# Altium project WS485H-V1_Project.PrjPcb
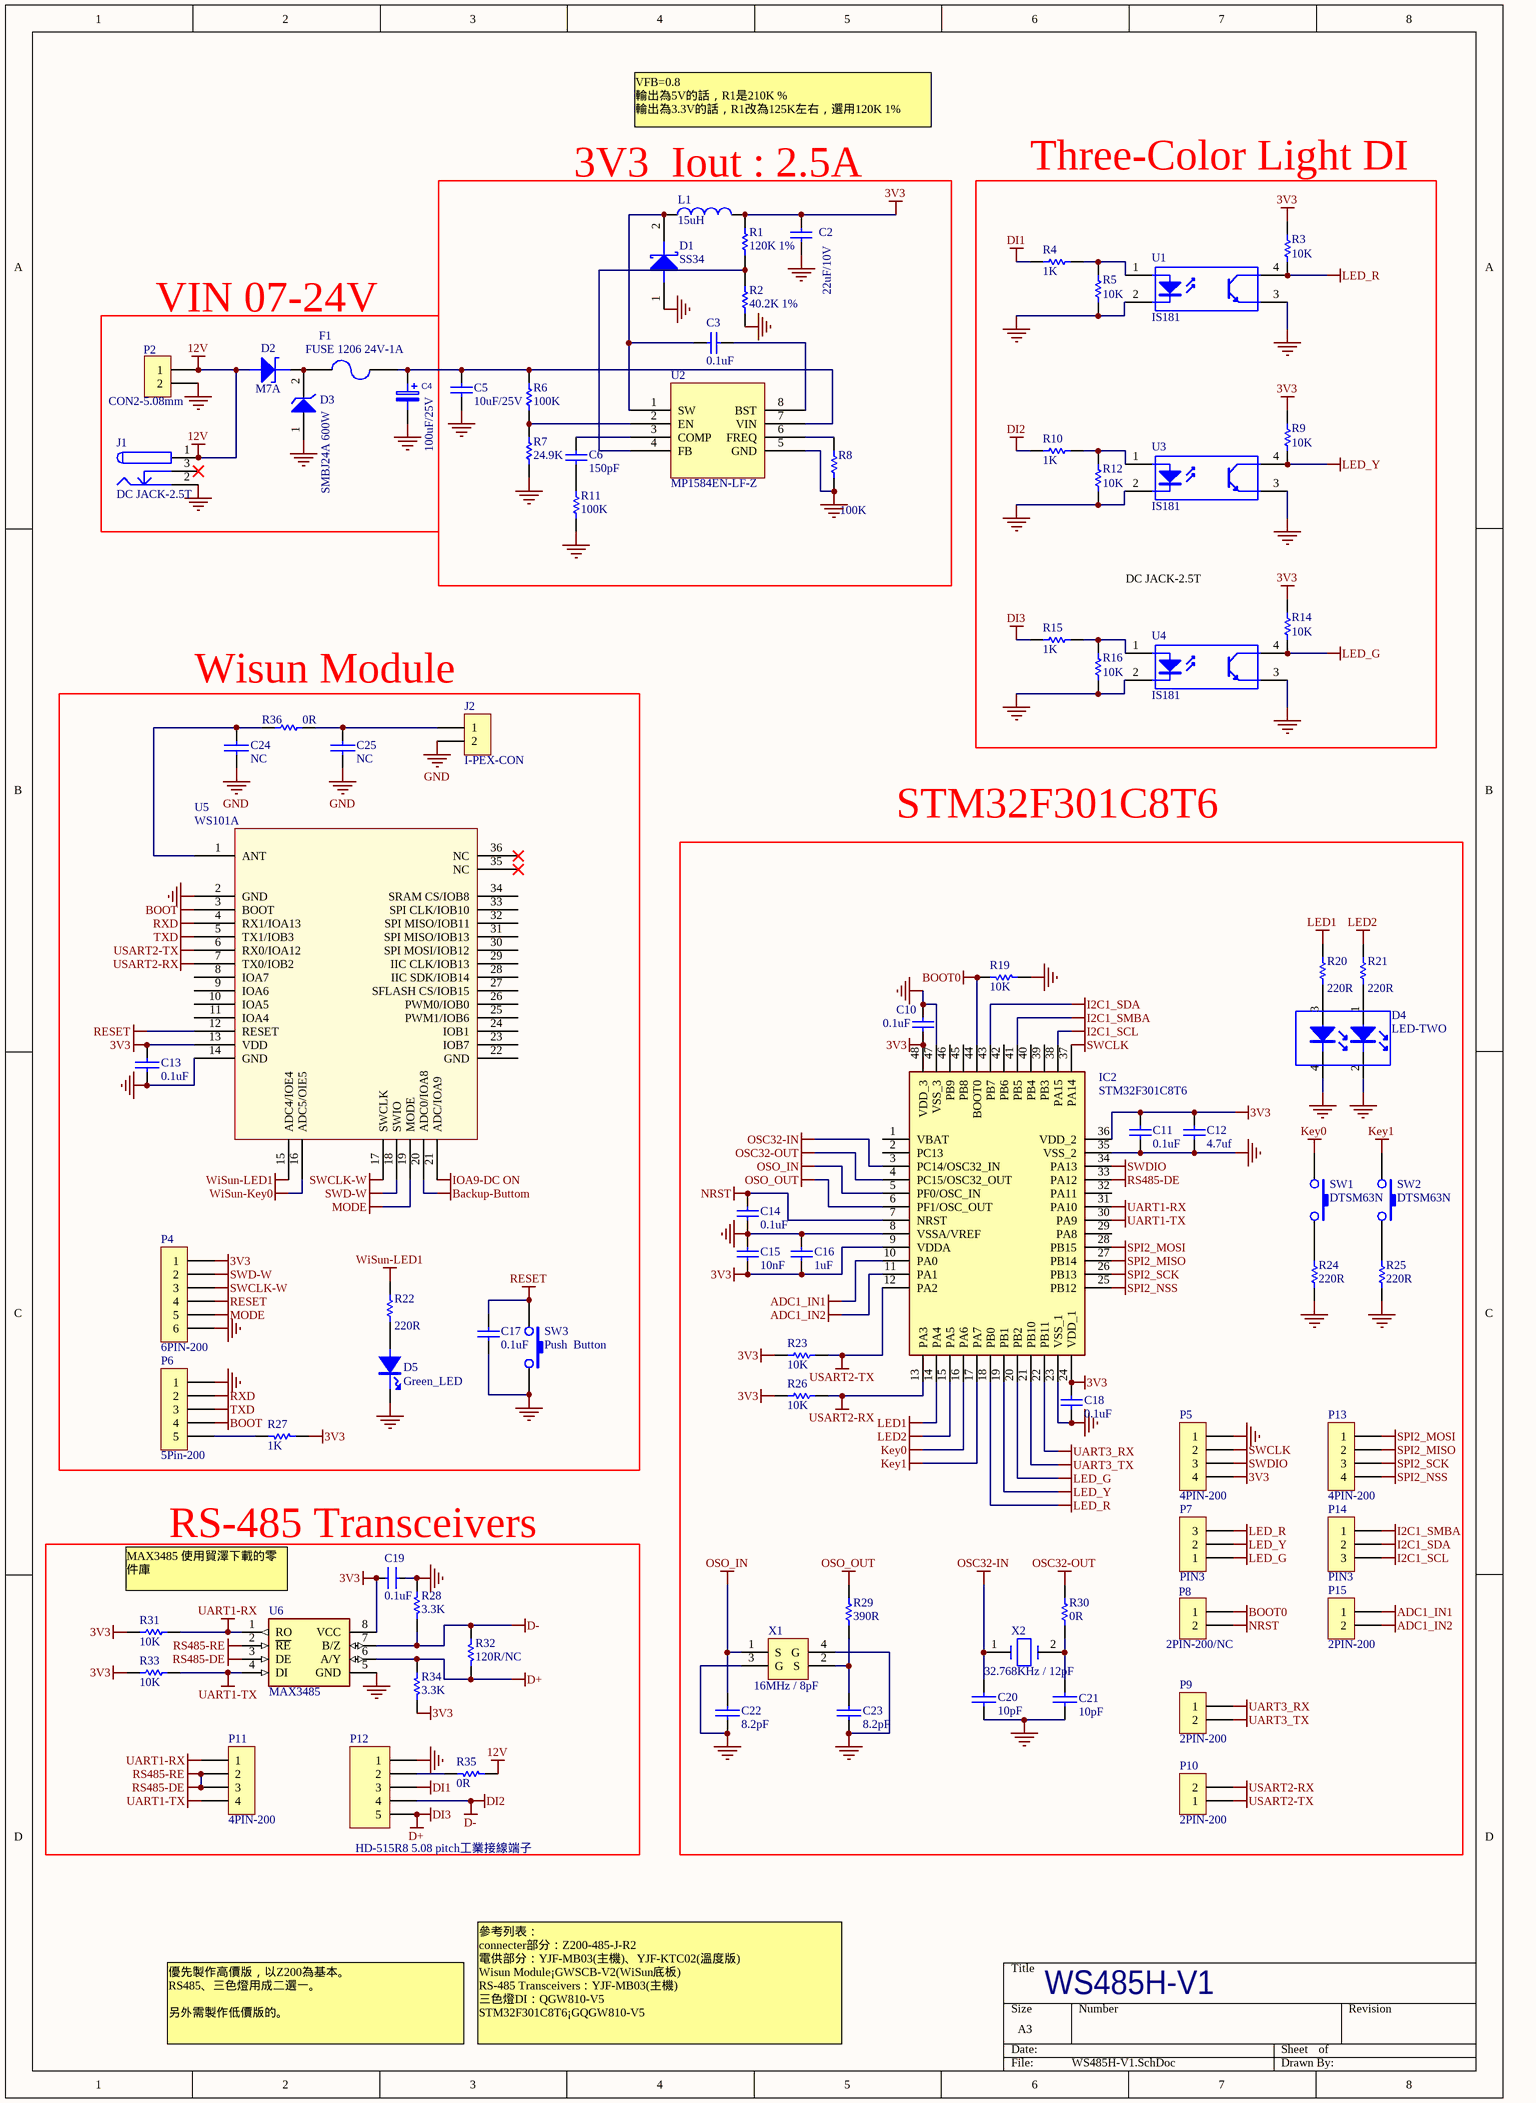
[diagram p0: WS485H-V1.SchDoc]
1 sheet, 88 parts. Net scope: global (net labels, ports and power ports of the same name join across sheets).
Board file: WS485H-V1.PcbDoc

## Sheet WS485H-V1.SchDoc: WS485H-V1
size A3 portrait; Author: Fred; PageSetup: Record=PageOptions|CenterHorizontal=True|CenterVertical=True|PrintScale=1.04|XCorrection=1.00|YCorrection=1.00|PrintKind=0|BorderSize=5000000|LeftOffset=0|BottomOffset=0|Orientation=1|PaperLength=1000|PaperWidth=1000|Scale=100|PaperSource=7|PrintQuality=-4|MediaType=1|DitherType=10|PaperKind=A3|PrintScaleMode=1

### Parts
C2  22uF/10V  [0402C]
C3  0.1uF  [0402C]
C4  100uF/25V  [DIP CAP-8*3.5]
C5  10uF/25V  [0805C]
C6  150pF  [0402C]
C10  0.1uF  [0402C]
C11  0.1uF  [0402C]
C12  value 4.7uf  [0402C]  (hidden comment: 0.1uF)
C13  0.1uF  [0402C]
C14  0.1uF  [0402C]
C15  value 10nF  [0603C]  (hidden comment: 0.1uF)
C16  value 1uF  [0402C]  (hidden comment: 0.1uF)
C17  0.1uF  [0402C]
C18  0.1uF  [0402C]
C19  0.1uF  [0402C]
C20  10pF  [0402C]
C21  10pF  [0402C]
C22  8.2pF  [0402C]
C23  8.2pF  [0402C]
C24  NC  [0402C]
C25  NC  [0402C]
D1  SS34  [SMBJ40CA(TVS)]
D2  M7A  [DIODE-SMA]
D3  SMBJ24A 600W  [SMBJ40CA(TVS)]
D4  LED-TWO  [LEDX2HOLD]
D5  Green_LED  [LED0603--0.4mm]
F1  FUSE 1206 24V-1A  [1206-FUSE]
IC2  STM32F301C8T6  [QFP50P900X900X160-48N]
J1  DC JACK-2.5T  [DC JACK-2.5T-NEW]
J2  I-PEX-CON  [I-PEX-CON]
L1  15uH  [L8.3x8.3]
P2  CON2-5.08mm  [OQ5.08-90D-2P]
P4  6PIN-200  [6PIN-200]
P5  4PIN-200  [4PIN-200]
P6  5Pin-200  [5pin-200]
P7  PIN3  [3PIN-200]
P8  2PIN-200/NC  [2PIN-200]
P9  2PIN-200  [2PIN-200]
P10  2PIN-200  [2PIN-200]
P11  4PIN-200  [4PIN-200]
P12  HD-515R8 5.08 pitch工業接線端子  [OQ5.08-90D-5P]
P13  4PIN-200  [4PIN-200]
P14  PIN3  [3PIN-200]
P15  2PIN-200  [2PIN-200]
R1  value 120K 1%  [0402]  (hidden comment: 210K 1%)
R2  40.2K 1%  [0402]
R3  10K  [0402]
R4  1K  [0402]
R5  10K  [0402]
R6  100K  [0402]
R7  24.9K  [0402]
R8  100K  [0402]
R9  10K  [0402]
R10  1K  [0402]
R11  100K  [0402]
R12  10K  [0402]
R14  10K  [0402]
R15  1K  [0402]
R16  10K  [0402]
R19  10K  [0402]
R20  220R  [0603]
R21  220R  [0603]
R22  220R  [0402]
R23  10K  [0402]
R24  220R  [0603]
R25  220R  [0603]
R26  10K  [0402]
R27  1K  [0402]
R28  3.3K  [0603]
R29  390R  [0402]
R30  0R  [0402]
R31  10K  [0402]
R32  120R/NC  [0603]
R33  10K  [0402]
R34  3.3K  [0603]
R35  0R  [0805]
R36  0R  [0603]
SW1  DTSM63N  [SW-AT-1102VT1-new]
SW2  DTSM63N  [SW-AT-1102VT1-new]
SW3  Push  Button  [Button_2pin-3*4*2MM]
U1  IS181  [IS181-SMD]
U2  MP1584EN-LF-Z  [SOIC8E_MP1584EN]
U3  IS181  [IS181-SMD]
U4  IS181  [IS181-SMD]
U5  WS101A  [WS101A]
U6  MAX3485  [SOIC127P600X175-8N]
X1  16MHz / 8pF  [XTAL-SMD-20X16]
X2  32.768KHz / 12pF  [XTAL-SMD-32*15]

### Blocks framed on the sheet
3V3  Iout : 2.5A: C2 C3 C5 C6 D1 L1 R1 R2 R6-R8 R11 U2
Three-Color Light DI: R3-R5 R9 R10 R12 R14-R16 U1 U3 U4
VIN 07-24V: C4 D2 D3 F1 J1 P2
Wisun Module: C13 C17 C24 C25 D5 J2 P4 P6 R22 R27 R36 SW3 U5
STM32F301C8T6: C10-C12 C14-C16 C18 C20-C23 D4 IC2 P5 P7-P10 P13-P15 R19-R21 R23-R26 R29 R30 SW1 SW2 X1 X2
RS-485 Transceivers: C19 P11 P12 R28 R31-R35 U6

### Nets
3V3: C2.2 C10.2 C11.1 C12.1 C13.2 C15.1 C16.1 C18.1 C19.1 IC2.9(VDDA) IC2.24(VDD_1) IC2.36(VDD_2) IC2.48(VDD_3) L1.2 P4.1 P5.4 R1.2 R3.2 R9.2 R14.2 R23.2 R26.2 R27.1 R31.2 R33.2 R34.2 U5.13(VDD) U6.8(VCC)
12V: D2.1 J1.1 P2.1 R35.1
ADC1_IN1: IC2.10(PA0) P15.1
ADC1_IN2: IC2.11(PA1) P15.2
Backup-Buttom: U5.20(ADC0/IOA8)
BOOT: P6.4 U5.3(BOOT)
BOOT0: IC2.44(BOOT0) P8.1 R19.2
D+: P12.5 R15.1 R32.2 R34.1 U6.6(A/Y)  [also labelled DI3]
D-: P12.4 R10.1 R28.2 R32.1 U6.7(B/Z)  [also labelled DI2]
DI1: P12.3 R4.1
GND: C2.1 C4.2 C5.1 C10.1 C11.2 C12.2 C13.1 C14.1 C15.2 C16.2 C17.2 C18.2 C19.2 C20.2 C21.2 C22.2 C23.2 C24.1 C25.1 D1.1 D3.1 D4.2 D4.4 D5.2 IC2.8(VSSA/VREF) IC2.23(VSS_1) IC2.35(VSS_2) IC2.47(VSS_3) J1.2 J2.2 P2.2 P4.6 P5.1 P6.1 P12.1 R2.1 R5.1 R7.1 R8.1 R11.1 R12.1 R16.1 R19.1 R24.2 R25.2 R28.1 SW1.0(GND) SW2.0(GND) SW3.2 U1.2 U1.3 U2.0(GND) U2.5(GND) U3.2 U3.3 U4.2 U4.3 U5.2(GND) U5.14(GND) U6.5(GND) X1.3(G) X1.4(G)
I2C1_SCL: IC2.38(PA15) P14.3
I2C1_SDA: IC2.43(PB7) P14.2
I2C1_SMBA: IC2.41(PB5) P14.1
IOA9-DC ON: U5.21(ADC/IOA9)
Key0: IC2.16(PA6) SW1.1
Key1: IC2.17(PA7) SW2.1
LED1: IC2.14(PA4) R20.2
LED2: IC2.15(PA5) R21.2
LED_G: IC2.20(PB2) P7.1 R14.1 U4.4
LED_R: IC2.18(PB0) P7.3 R3.1 U1.4
LED_Y: IC2.19(PB1) P7.2 R9.1 U3.4
MODE: P4.5 U5.19(MODE)
NRST: C14.2 IC2.7(NRST) P8.2
OSC32-IN: C20.1 IC2.3(PC14/OSC32_IN) X2.1
OSC32-OUT: IC2.4(PC15/OSC32_OUT) R30.1
OSO_IN: C22.1 IC2.5(PF0/OSC_IN) X1.1(S)
OSO_OUT: IC2.6(PF1/OSC_OUT) R29.1
RESET: C17.1 P4.4 SW3.1 U5.12(RESET)
RS485-DE: IC2.33(PA12) P11.2 P11.3 U6.2(~{RE}) U6.3(DE)  [also labelled RS485-RE]
RXD: P6.2 U5.4(RX1/IOA13)
SPI2_MISO: IC2.27(PB14) P13.2
SPI2_MOSI: IC2.28(PB15) P13.1
SPI2_NSS: IC2.25(PB12) P13.4
SPI2_SCK: IC2.26(PB13) P13.3
SWCLK: IC2.37(PA14) P5.2
SWCLK-W: P4.3 U5.17(SWCLK)
SWD-W: P4.2 U5.18(SWIO)
SWDIO: IC2.34(PA13) P5.3
TXD: P6.3 U5.5(TX1/IOB3)
UART1-RX: IC2.31(PA10) P11.1 R31.1 U6.1(RO)
UART1-TX: IC2.30(PA9) P11.4 R33.1 U6.4(DI)
UART3_RX: IC2.22(PB11) P9.1
UART3_TX: IC2.21(PB10) P9.2
USART2-RX: IC2.13(PA3) P10.2 R26.1 U5.7(TX0/IOB2)
USART2-TX: IC2.12(PA2) P10.1 R23.1 U5.6(RX0/IOA12)
WiSun-Key0: U5.16(ADC5/OIE5)
WiSun-LED1: R22.2 U5.15(ADC4/IOE4)
NetC3_1: C3.1 U2.8(BST)
NetC3_2: C3.2 D1.2 L1.1 U2.1(SW)
NetC4_1: C4.1 C5.2 F1.2 R6.2 U2.7(VIN)
NetC6_1: C6.1 R11.2
NetC6_2: C6.2 U2.3(COMP)
NetC21_1: C21.1 R30.2 X2.2
NetC23_1: C23.1 R29.2 X1.2(S)
NetC24_2: C24.2 R36.1 U5.1(ANT)
NetC25_2: C25.2 J2.1 R36.2
NetD2_2: D2.2 D3.2 F1.1
NetD4_1: D4.1 R21.1
NetD4_3: D4.3 R20.1
NetD5_1: D5.1 R22.1
NetP6_5: P6.5 R27.2
NetP12_2: P12.2 R35.2
NetR1_1: R1.1 R2.2 U2.4(FB)
NetR4_2: R4.2 R5.2 U1.1
NetR6_1: R6.1 R7.2 U2.2(EN)
NetR8_2: R8.2 U2.6(FREQ)
NetR10_2: R10.2 R12.2 U3.1
NetR15_2: R15.2 R16.2 U4.1
NetR24_1: R24.1 SW1.2
NetR25_1: R25.1 SW2.2

Not connected (* = marked no-connect by the designer): IC2 1(VBAT) 2(PC13) 29(PA8) 32(PA11) 39(PB3) 40(PB4) 42(PB6) 45(PB8) 46(PB9); J1 3*; U5 8(IOA7) 9(IOA6) 10(IOA5) 11(IOA4) 22(GND) 23(IOB7) 24(IOB1) 25(PWM1/IOB6) 26(PWM0/IOB0) 27(SFLASH_CS/IOB15) 28(IIC_SDK/IOB14) 29(IIC_CLK/IOB13) 30(SPI_MOSI/IOB12) 31(SPI_MISO/IOB13) 32(SPI_MISO/IOB11) 33(SPI_CLK/IOB10) 34(SRAM_CS/IOB8) 35(NC)* 36(NC)*

### Notes on the sheet
- VFB=0.8
  輸出為5V的話，R1是210K %
  輸出為3.3V的話，R1改為125K左右，選用120K 1%
- DC JACK-2.5T
- MAX3485 使用貿澤下載的零件庫
- 註解快捷鍵：P+E+O
- 問題：
  ．12V保險絲為何用1A & 為何要保險絲
  ．關於RS485，D+D-中間為何要有個NC電阻
- 優先製作高價版，以Z200為基本。
  RS485、三色燈用成二選一。
  另外需製作低價版的。
- 參考列表：
  connecter部分：Z200-485-J-R2
  電供部分：YJF-MB03(主機)、YJF-KTC02(溫度版)
  Wisun Module¡GWSCB-V2(WiSun底板)
  RS-485 Transceivers：YJF-MB03(主機)
  三色燈DI：QGW810-V5
  STM32F301C8T6¡GQGW810-V5

### Library data of the parts
C2 C3 C5 C6 C10-C12 C14-C18 = Cap Semi: Capacitor (Semiconductor SIM Model); Published: 8-Jun-2000; LatestRevisionDate: 17-Jul-2002; LatestRevisionNote: Re-released for DXP Platform.; PackageReference: C1206; Publisher: Altium Limited
  C2: Value: 22uF/10V
  C3 C10 C11 C14 C17 C18: Value: 0.1uF
  C5: Value: 10uF/25V
  C6: Value: 150pF
C4 = C POL: Part Number: 53300833000; Right: 20; Tolerance: 20%; Rating: 10V; Package Height: 1.8mm; PCB_x: 19.129500; PCB_y: 12.184000; PCB_dir: 0.000000; PCB_loc: Top; Bottom: 20; Value: 100uF/25V
C13 C20-C25 = CAP: Capacitor
  C13: Value: 0.1uF
C19 = CAP
D1 = DIODE SCHOTTKY: Schottky Diode
D2 = ZNQ: Zener Diode
D3 = PESD5V0L1BA: Zener Diode
D5 = LED: Manufacturer's Part Number: CL-170G-CD-T; Part Number: 41100017000; Manufacturer: Citizen; Old Part Number: 4317000; Right: 40; Bottom: 20; VALUE_ALLEGRO: Red_LED; Package Height: 1.1mm; FPLIST: mot/0805LED,dig/0805led; PCB_x: 46.095000; PCB_y: 6.420000; PCB_dir: 90.000000; Cost: 0.48
F1 = FUSE2: Fuse
IC2 = STM32F301C8T6: Integrated Circuit; Manufacturer_Name: STMicroelectronics; Datasheet Link: https://www.st.com/resource/en/datasheet/stm32f301c8.pdf; Height: 1.6mm; Manufacturer_Part_Number: STM32F301C8T6
J1 = DCJACK-1: Low Voltage Power Supply Connector; Published: *; DatasheetDocument: *; Publisher: *; ComponentLink1Description: *; ComponentLink1URL: *
J2 P2 P8-P10 P15 = CON2: Connector
L1 = Inductor: Code_IEC: 1005; Published: 8-Jun-2000; LatestRevisionDate: 17-Jul-2002; LatestRevisionNote: Re-released for DXP Platform.; PackageReference: 0402-A; Publisher: Altium Limited; Code_JEITA: 0402; Value: 15uH
P4 = 6PIN-200: Pin Header; LatestRevisionDate: 17-Jul-2002; LatestRevisionNote: Re-released for DXP Platform.; Publisher: Altium Limited
P5 P11 P13 = CON4: Connector; Value: MicroUSB
P6 = PIN5
P7 P14 = PIN3: Connector
P12 = Header 5: Header, 5-Pin; LatestRevisionDate: 17-Jul-2002; LatestRevisionNote: Re-released for DXP Platform.; Publisher: Altium Limited
R1-R12 R14-R16 R19-R34 R36 = Res Semi: Semiconductor Resistor; Published: 8-Jun-2000; LatestRevisionDate: 17-Jul-2002; LatestRevisionNote: Re-released for DXP Platform.; PackageReference: AXIAL-0.5; Publisher: Altium Limited
  R2: Value: 40.2K 1%
  R3 R5 R9 R12 R14 R16 R19 R23 R26 R31 R33: Value: 10K
  R4 R10 R15 R27: Value: 1K
  R6 R8 R11: Value: 100K
  R7: Value: 24.9K
  R20-R22 R24 R25: Value: 220R
  R28 R34: Value: 3.3K
  R29: Value: 390R
  R30 R36: Value: 0R
  R32: Value: 120R/NC
R35 = Res Semi: Semiconductor Resistor; Value: 0R/NC; Published: 8-Jun-2000; LatestRevisionDate: 17-Jul-2002; LatestRevisionNote: Re-released for DXP Platform.; PackageReference: AXIAL-0.5; Publisher: Altium Limited
SW1 SW2 = SW1
SW3 = SW1: Push Button; Value: Switch-SMD-6x6mm
U1 U3 U4 = Optoisolator1: 4-Pin Phototransistor Optocoupler; Published: 24-Mar-1999; LatestRevisionDate: 04-Mar-2005; LatestRevisionNote: Sch pins 3 & 4 Swapped.; DatasheetDocument: Nov-2003; PackageReference: DIP-4; Publisher: Altium Limited
U6 = ISL3178EIBZ-T: Integrated Circuit; Manufacturer_Name: Renesas Electronics; Datasheet Link: https://www.renesas.com/en-us/www/doc/datasheet/isl3170e-71e-72e-73e-74e-75e-76e-77e-78e.pdf; Height: 1.75mm; Manufacturer_Part_Number: ISL3178EIBZ-T
X1 = XTAL-SMD-25*32
X2 = XTAL: Text Field1: 20; Text Field2: 20